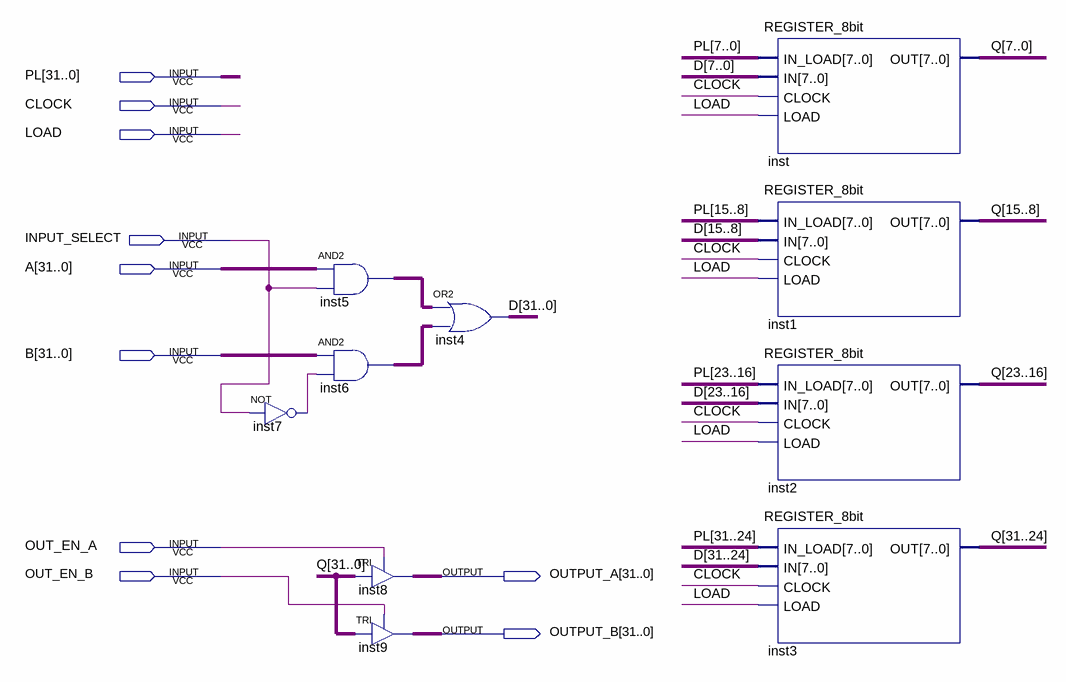
[diagram p0: schematic sheet]
// Quartus schematic REGISTER_32bit.bdf as structural Verilog: 10 symbols, 10 pins
module REGISTER_32bit (
  input  [31:0] PL,
  input  CLOCK,
  input  LOAD,
  input  INPUT_SELECT,
  input  [31:0] A,
  input  [31:0] B,
  input  OUT_EN_A,
  input  OUT_EN_B,
  output [31:0] OUTPUT_A,
  output [31:0] OUTPUT_B
);

  wire inst7_out;
  wire [31:0] D, inst5_out, inst6_out, Q;

  not inst7 (inst7_out, INPUT_SELECT);
  assign inst5_out = A & {32{INPUT_SELECT}};  // AND2 inst5, 32 bits wide
  assign inst6_out = B & {32{inst7_out}};  // AND2 inst6, 32 bits wide
  TRI inst8[31:0] (.IN(Q), .OE(OUT_EN_A), .OUT(OUTPUT_A));
  TRI inst9[31:0] (.IN(Q), .OE(OUT_EN_B), .OUT(OUTPUT_B));
  assign D = inst5_out | inst6_out;  // OR2 inst4, 32 bits wide
  REGISTER_8bit inst (.IN_LOAD(PL[7:0]), .IN(D[7:0]), .CLOCK(CLOCK), .LOAD(LOAD), .OUT(Q[7:0]));
  REGISTER_8bit inst1 (.IN_LOAD(PL[15:8]), .IN(D[15:8]), .CLOCK(CLOCK), .LOAD(LOAD), .OUT(Q[15:8]));
  REGISTER_8bit inst2 (.IN_LOAD(PL[23:16]), .IN(D[23:16]), .CLOCK(CLOCK), .LOAD(LOAD), .OUT(Q[23:16]));
  REGISTER_8bit inst3 (.IN_LOAD(PL[31:24]), .IN(D[31:24]), .CLOCK(CLOCK), .LOAD(LOAD), .OUT(Q[31:24]));
endmodule
